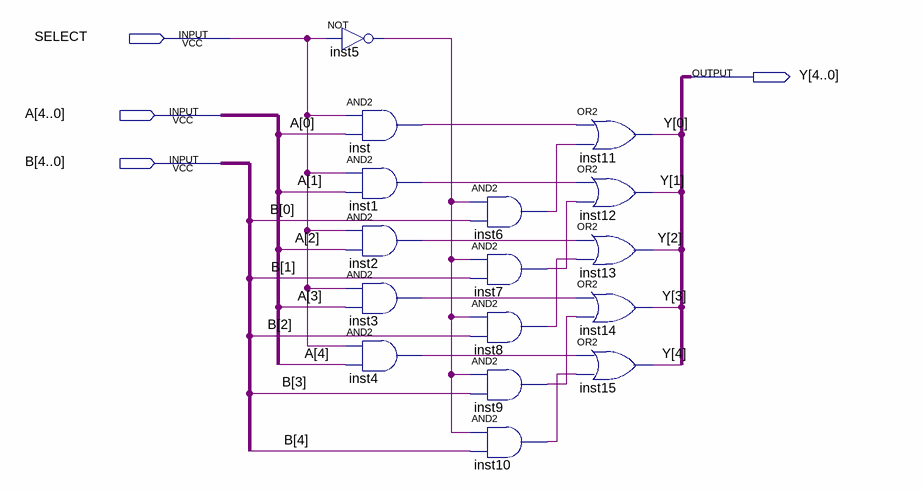
[diagram p0: schematic sheet]
// Quartus schematic mux_2.bdf as structural Verilog: 16 symbols, 4 pins
module mux_2 (
  input  SELECT,
  input  [4:0] A,
  input  [4:0] B,
  output [4:0] Y
);

  wire inst1_out, inst2_out, inst3_out, inst4_out, inst5_out, inst6_out, inst7_out, inst8_out, inst9_out,
       inst10_out, inst_out;

  not inst5 (inst5_out, SELECT);
  and inst (inst_out, SELECT, A[0]);
  and inst1 (inst1_out, SELECT, A[1]);
  and inst2 (inst2_out, SELECT, A[2]);
  and inst3 (inst3_out, SELECT, A[3]);
  and inst4 (inst4_out, SELECT, A[4]);
  and inst6 (inst6_out, inst5_out, B[0]);
  and inst7 (inst7_out, inst5_out, B[1]);
  and inst8 (inst8_out, inst5_out, B[2]);
  and inst9 (inst9_out, inst5_out, B[3]);
  and inst10 (inst10_out, inst5_out, B[4]);
  or inst11 (Y[0], inst_out, inst6_out);
  or inst12 (Y[1], inst1_out, inst7_out);
  or inst13 (Y[2], inst2_out, inst8_out);
  or inst14 (Y[3], inst3_out, inst9_out);
  or inst15 (Y[4], inst4_out, inst10_out);
endmodule
